# Altium schematic sheet STM32_Board_Shematic.SchDoc
size A
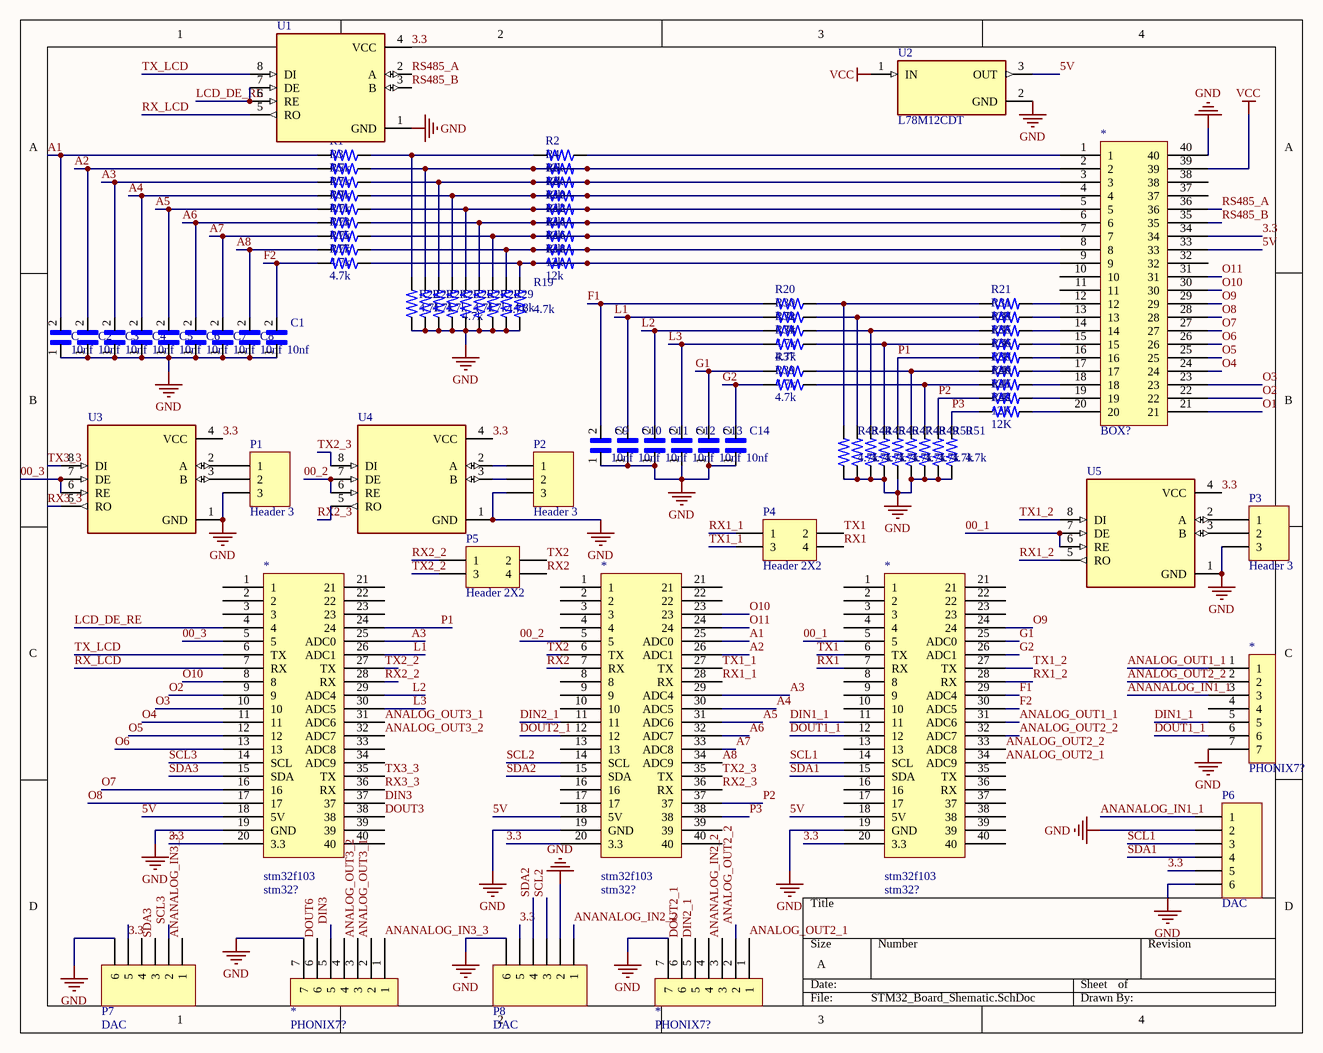
[diagram p0: STM32_Board_Shematic.SchDoc]

## Parts
(Parts that share a designator on the sheet are numbered #1, #2 ... from top to bottom, then left to right.)
*#1  BOX?  [BOX HEADER 2X20]
*#2  stm32?  [stm32f103c8t6]
*#3  stm32?  [stm32f103c8t6]
*#4  stm32?  [stm32f103c8t6]
*#5  PHONIX7?  [PHONIX7]
*#6  PHONIX7?  [PHONIX7]
*#7  PHONIX7?  [PHONIX7]
C  10nf  [CAPC3216X190]
C1  10nf  [CAPC3216X190]
C2  10nf  [CAPC3216X190]
C3  10nf  [CAPC3216X190]
C4  10nf  [CAPC3216X190]
C5  10nf  [CAPC3216X190]
C6  10nf  [CAPC3216X190]
C7  10nf  [CAPC3216X190]
C8  10nf  [CAPC3216X190]
C9  10nf  [CAPC3216X190]
C10  10nf  [CAPC3216X190]
C11  10nf  [CAPC3216X190]
C12  10nf  [CAPC3216X190]
C13  10nf  [CAPC3216X190]
C14  10nf  [CAPC3216X190]
P1  Header 3  [HDR1X3]
P2  Header 3  [HDR1X3]
P3  Header 3  [HDR1X3]
P4  Header 2X2  [HDR2X2]
P5  Header 2X2  [HDR2X2]
P6  DAC  [HDR1X6]
P7  DAC  [HDR1X6]
P8  DAC  [HDR1X6]
R1  4.7k  [RESC3115X65N]
R2  12k  [RESC3115X65N]
R3  4.7k  [RESC3115X65N]
R4  12k  [RESC3115X65N]
R5  4.7k  [RESC3115X65N]
R6  12k  [RESC3115X65N]
R7  4.7k  [RESC3115X65N]
R8  12k  [RESC3115X65N]
R9  4.7k  [RESC3115X65N]
R10  12k  [RESC3115X65N]
R11  4.7k  [RESC3115X65N]
R12  12k  [RESC3115X65N]
R13  4.7k  [RESC3115X65N]
R14  12k  [RESC3115X65N]
R15  4.7k  [RESC3115X65N]
R16  12k  [RESC3115X65N]
R17  4.7k  [RESC3115X65N]
R18  12k  [RESC3115X65N]
R19  4.7k  [RESC3115X65N]
R20  4.7k  [RESC3115X65N]
R21  12K  [RESC3115X65N]
R22  4.7k  [RESC3115X65N]
R23  4.7k  [RESC3115X65N]
R24  4.7k  [RESC3115X65N]
R25  4.7k  [RESC3115X65N]
R26  4.7k  [RESC3115X65N]
R27  4.7k  [RESC3115X65N]
R28  4.7k  [RESC3115X65N]
R29  4.8k  [RESC3115X65N]
R30  4.7k  [RESC3115X65N]
R31  12K  [RESC3115X65N]
R32  4.7k  [RESC3115X65N]
R33  12K  [RESC3115X65N]
R34  4.7k  [RESC3115X65N]
R35  12K  [RESC3115X65N]
R36  12K  [RESC3115X65N]
R37  4.7k  [RESC3115X65N]
R38  12K  [RESC3115X65N]
R39  4.7k  [RESC3115X65N]
R40  12K  [RESC3115X65N]
R41  12K  [RESC3115X65N]
R42  12K  [RESC3115X65N]
R43  4.7k  [RESC3115X65N]
R44  4.7k  [RESC3115X65N]
R45  4.7k  [RESC3115X65N]
R46  4.7k  [RESC3115X65N]
R47  4.7k  [RESC3115X65N]
R48  4.7k  [RESC3115X65N]
R49  4.7k  [RESC3115X65N]
R50  4.7k  [RESC3115X65N]
R51  4.7k  [RESC3115X65N]
U1  MAX485_MODULE_5V_LOGIC_TLL_TO_RS-485_CONVERTER  [MODULE_MAX485_MODULE_5V_LOGIC_TLL_TO_RS-485_CONVERTER]  (value not drawn)
U2  L78M12CDT  [VREG_L78M12CDT]
U3  MAX485_MODULE_5V_LOGIC_TLL_TO_RS-485_CONVERTER  [MODULE_MAX485_MODULE_5V_LOGIC_TLL_TO_RS-485_CONVERTER]  (value not drawn)
U4  MAX485_MODULE_5V_LOGIC_TLL_TO_RS-485_CONVERTER  [MODULE_MAX485_MODULE_5V_LOGIC_TLL_TO_RS-485_CONVERTER]  (value not drawn)
U5  MAX485_MODULE_5V_LOGIC_TLL_TO_RS-485_CONVERTER  [MODULE_MAX485_MODULE_5V_LOGIC_TLL_TO_RS-485_CONVERTER]  (value not drawn)

## Nets
GND: *#1.40 *#2.19(GND) *#3.19(GND) *#4.19(GND) *#5.7 *#6.7 *#7.7 C.1 C1.1 C2.1 C3.1 C4.1 C5.1 C6.1 C7.1 C8.1 C9.1 C10.1 C11.1 C12.1 C13.1 C14.1 P1.3 P2.3 P3.3 P6.2 P6.6 P7.6 P8.2 P8.6 R19.1 R22.1 R23.1 R24.1 R25.1 R26.1 R27.1 R28.1 R29.1 R43.1 R44.1 R45.1 R46.1 R47.1 R48.1 R49.1 R50.1 R51.1 U1.1(GND) U2.2(GND) U3.1(GND) U4.1(GND) U5.1(GND)
VCC: *#1.39 U2.1(IN)
00_1: *#4.5 U5.6(RE) U5.7(DE)
00_2: *#3.5 U4.6(RE) U4.7(DE)
00_3: *#2.5 U3.6(RE) U3.7(DE)
3.3: *#1.34 *#2.20(3.3) *#3.20(3.3) *#4.20(3.3) P6.5 P7.5 P8.5 U1.4(VCC) U3.4(VCC) U4.4(VCC) U5.4(VCC)
5V: *#1.33 *#2.18(5V) *#3.18(5V) *#4.18(5V) U2.3(OUT)
\: *#3.35(TX) U4.8(DI)  [also labelled TX2_3]
A1: *#3.25(ADC0) C.2 R1.2
A2: *#3.26(ADC1) C2.2 R3.2
A3: *#2.25(ADC0) *#3.29(ADC4) C3.2 R5.2
A4: *#3.30(ADC5) C4.2 R7.2
A5: *#3.31(ADC6) C5.2 R9.2
A6: *#3.32(ADC7) C6.2 R11.2
A7: *#3.33(ADC8) C7.2 R13.2
A8: *#3.34(ADC9) C8.2 R15.2
ANALOG_OUT1_1: *#4.31(ADC6) *#5.1
ANALOG_OUT2_1: *#4.34(ADC9) *#7.1
ANALOG_OUT2_2: *#4.32(ADC7) *#4.33(ADC8) *#5.2 *#7.2
ANALOG_OUT3_1: *#2.31(ADC6) *#6.2
ANALOG_OUT3_2: *#2.32(ADC7) *#6.3
ANANALOG_IN1_1: *#5.3 P6.1
ANANALOG_IN2_2: *#7.3 P8.1
ANANALOG_IN3_3: *#6.1 P7.1
DIN1_1: *#4.11 *#5.5
DIN2_1: *#3.11 *#7.5
DIN3: *#2.37 *#6.5
DOUT1_1: *#4.12 *#5.6
DOUT2_1: *#3.12 *#7.6
DOUT3: *#2.38
DOUT6: *#6.6
F1: *#4.29(ADC4) C9.2 R20.2
F2: *#4.30(ADC5) C1.2 R17.2
G1: *#4.25(ADC0) C13.2 R37.2
G2: *#4.26(ADC1) C14.2 R39.2
L1: *#2.26(ADC1) C10.2 R30.2
L2: *#2.29(ADC4) C11.2 R32.2
L3: *#2.30(ADC5) C12.2 R34.2
LCD_DE_RE: *#2.4 U1.6(RE) U1.7(DE)
O1: *#1.21
O2: *#1.22 *#2.9
O3: *#1.23 *#2.10
O4: *#1.24 *#2.11
O5: *#1.25 *#2.12
O6: *#1.26 *#2.13
O7: *#1.27 *#2.16
O8: *#1.28 *#2.17
O9: *#1.29 *#4.24
O10: *#1.30 *#2.8 *#3.23
O11: *#1.31 *#3.24
P1: *#2.24 R36.1 R47.2
P2: *#3.37 R41.1 R50.2
P3: *#3.38 R42.1 R51.2
RS485_A: *#1.36 U1.2(A)
RS485_B: *#1.35 U1.3(B)
RX1: *#4.7(RX) P4.4
RX1_1: *#3.28(RX) P4.1
RX1_2: *#4.28(RX) U5.5(RO)
RX2: *#3.7(RX) P5.4
RX2_2: *#2.28(RX) P5.1
RX2_3: *#3.36(RX) U4.5(RO)
RX3_3: *#2.36(RX) U3.5(RO)
RX_LCD: *#2.7(RX) U1.5(RO)
SCL1: *#4.14(SCL) P6.3
SCL2: *#3.14(SCL) P8.3
SCL3: *#2.14(SCL) P7.2
SDA1: *#4.15(SDA) P6.4
SDA2: *#3.15(SDA) P8.4
SDA3: *#2.15(SDA) P7.3
TX1: *#4.6(TX) P4.2
TX1_1: *#3.27(TX) P4.3
TX1_2: *#4.27(TX) U5.8(DI)
TX2: *#3.6(TX) P5.2
TX2_2: *#2.27(TX) P5.3
TX3_3: *#2.35(TX) U3.8(DI)
TX_LCD: *#2.6(TX) U1.8(DI)
Net*#1_1: *#1.1 R2.1
Net*#1_2: *#1.2 R3.1 R4.1 R4.2 R23.2
Net*#1_3: *#1.3 R5.1 R6.1 R6.2 R24.2
Net*#1_4: *#1.4 R7.1 R8.1 R8.2 R25.2
Net*#1_5: *#1.5 R9.1 R10.1 R10.2 R26.2
Net*#1_6: *#1.6 R11.1 R12.1 R12.2 R27.2
Net*#1_7: *#1.7 R13.1 R14.1 R14.2 R28.2
Net*#1_8: *#1.8 R15.1 R16.1 R16.2 R29.2
Net*#1_9: *#1.9 R17.1 R18.1 R18.2 R19.2
Net*#1_12: *#1.12 R21.2
Net*#1_13: *#1.13 R31.2
Net*#1_14: *#1.14 R33.2
Net*#1_15: *#1.15 R35.2
Net*#1_16: *#1.16 R36.2
Net*#1_17: *#1.17 R38.2
Net*#1_18: *#1.18 R40.2
Net*#1_19: *#1.19 R41.2
Net*#1_20: *#1.20 R42.2
NetP1_1: P1.1 U3.2(A)
NetP1_2: P1.2 U3.3(B)
NetP2_1: P2.1 U4.2(A)
NetP2_2: P2.2 U4.3(B)
NetP3_1: P3.1 U5.2(A)
NetP3_2: P3.2 U5.3(B)
NetR1_1: R1.1 R2.2 R22.2
NetR20_1: R20.1 R21.1 R43.2
NetR30_1: R30.1 R31.1 R44.2
NetR32_1: R32.1 R33.1 R45.2
NetR34_1: R34.1 R35.1 R46.2
NetR37_1: R37.1 R38.1 R48.2
NetR39_1: R39.1 R40.1 R49.2

Not connected (* = marked no-connect by the designer): *#1 10 11 32 37 38; *#2 1 2 3 21 22 23 33(ADC8) 34(ADC9) 39 40; *#3 1 2 3 4 8 9 10 13 16 17 21 22 39 40; *#4 1 2 3 4 8 9 10 13 16 17 21 22 23 35(TX) 36(RX) 37 38 39 40; *#5 4; *#6 4; *#7 4; P7 4

## Notes on the sheet
- (in symbol stm32?) stm32f103

## Library data of the parts
C C1-C14 = GRM31CC80E157ME11K: Ceramic Capacitor; MF: Murata; Package: 1206 Murata; Value: *; Price: None; MP: GRM31CC80E157ME11K; SnapEDA_Link: https://www.snapeda.com/parts/GRM31CC80E157ME11K/Murata/view-part/2005125/?ref=snap; Availability: Unavailable
P1-P3 = Header 3: Header, 3-Pin; LatestRevisionDate: 17-Jul-2002; LatestRevisionNote: Re-released for DXP Platform.; Publisher: Altium Limited
P4 P5 = Header 2X2: Header, 2-Pin, Dual row; LatestRevisionDate: 17-Jul-2002; LatestRevisionNote: Re-released for DXP Platform.; Publisher: Altium Limited
P6-P8 = Header 6: Header, 6-Pin; LatestRevisionDate: 17-Jul-2002; LatestRevisionNote: Re-released for DXP Platform.; Publisher: Altium Limited
R1-R51 = 1879462-3: RL73H 2B R12 1% 5K RL; Package: None; Price: None; Value: *; MP: 1879462-3; Availability: Unavailable
U1 U3-U5 = MAX485_MODULE_5V_LOGIC_TLL_TO_RS-485_CONVERTER: 5V MAX485 TTL To RS485 Converter Module Board for Arduino; MP: MAX485 Module 5V logic TLL to RS-485 converter; MF: e-Gizmo Mechatronix Central; Value: *; SnapEDA_Link: https://www.snapeda.com/parts/MAX485%20Module%205V%20logic%20TLL%20to%20RS-485%20converter/e-Gizmo+Mechatronix+Central/view-part/?ref=snap; Package: Package; Availability: Not in stock; Check_prices: https://www.snapeda.com/parts/MAX485%20Module%205V%20logic%20TLL%20to%20RS-485%20converter/e-Gizmo+Mechatronix+Central/view-part/?ref=eda; Price: None
U2 = L78M12CDT: Linear Voltage Regulator IC Positive Fixed 1 Output 500mA I-PAK; MF: STMicroelectronics; Availability: In Stock; SnapEDA_Link: https://www.snapeda.com/parts/L78M12CDT/STMicroelectronics/view-part/?ref=snap; Price: None; MP: L78M12CDT; Purchase-URL: https://pricing.snapeda.com/search/part/L78M12CDT/?ref=eda; Package: DPAK STMicroelectronics; Value: *; Check_prices: https://www.snapeda.com/parts/L78M12CDT/STMicroelectronics/view-part/?ref=eda